# Altium schematic sheet Pre-Charge Detector.SchDoc
size A4; SheetNumber: 3; SheetTotal: 4
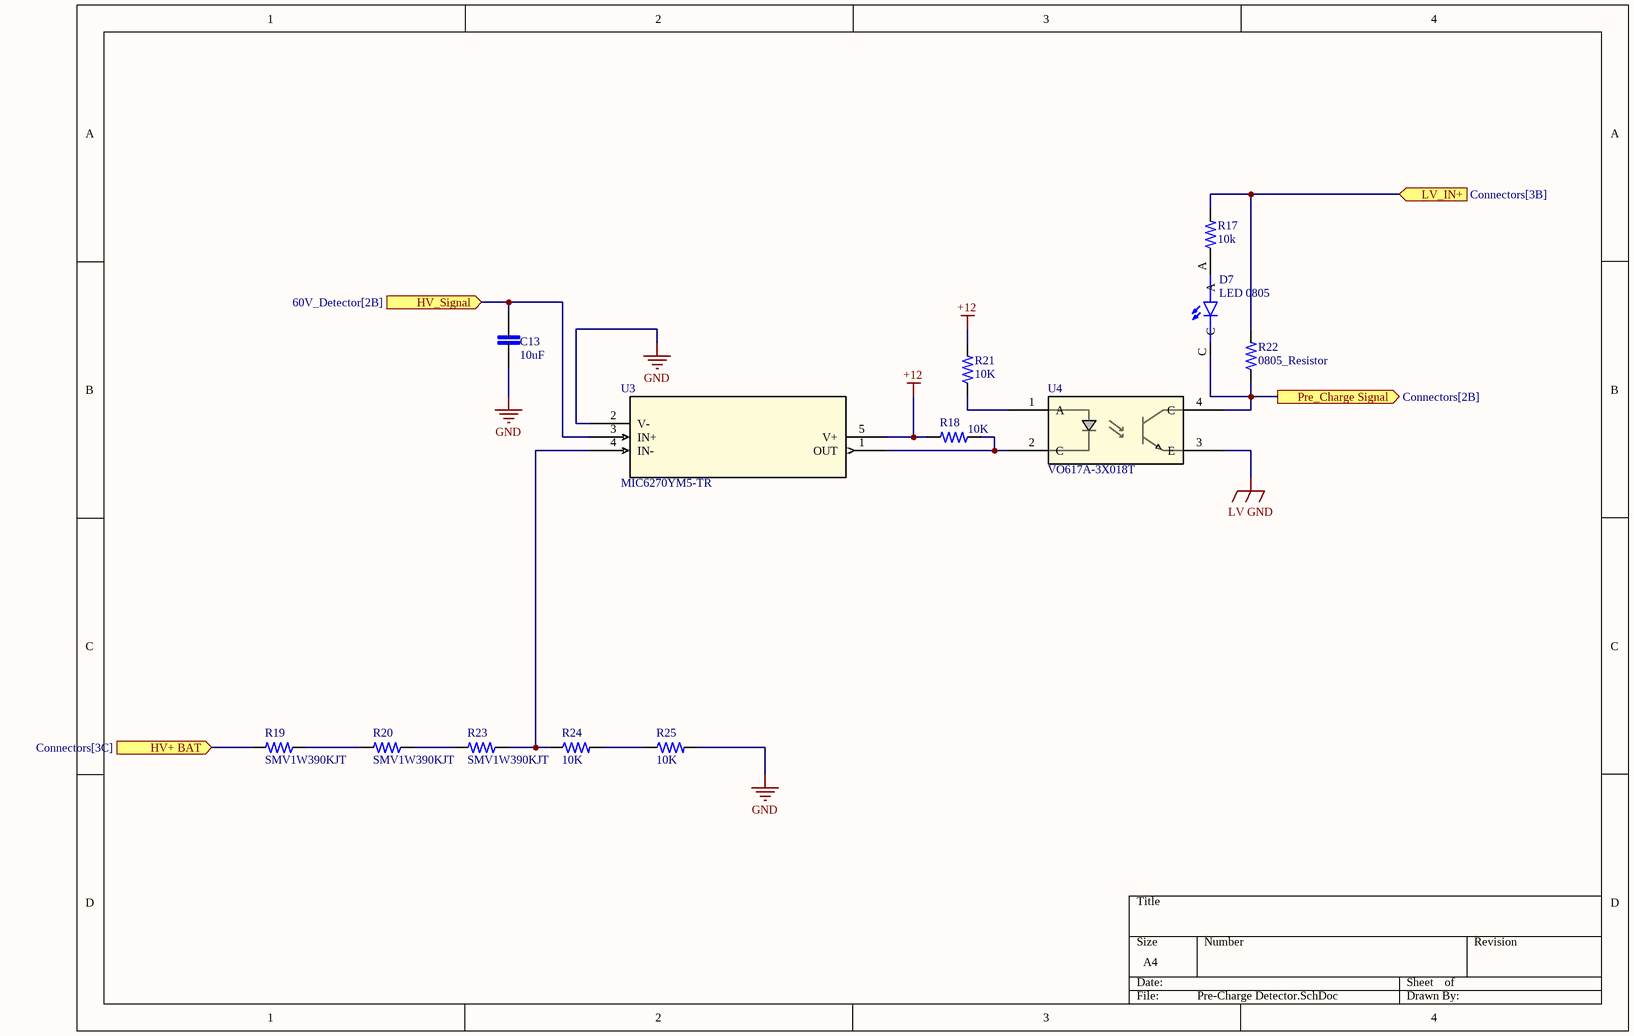
[diagram p0: Pre-Charge Detector.SchDoc]

## Parts
C13  10uF  [0805]
D7  LED 0805  [LED 0805]
R17  10k  [0805]
R18  10K  [0805]
R19  SMV1W390KJT  [SMV1W390KJT]
R20  SMV1W390KJT  [SMV1W390KJT]
R21  10K  [0805]
R22  0805_Resistor  [0805]
R23  SMV1W390KJT  [SMV1W390KJT]
R24  10K  [0805]
R25  10K  [0805]
U3  MIC6270YM5-TR  [MIC6270]
U4  VO617A-3X018T  [VO617A]

## Ports
HV+ BAT (in, see Connectors[3C]), HV_Signal (in, see 60V_Detector[2B]), LV_IN+ (in, see Connectors[3B]), Pre_Charge Signal (out, see Connectors[2B])

## Nets
+12: R18.2 R21.2 U3.5(V+)
GND: C13.1 R25.2 U3.2(V-)
LV GND: U4.3(E)
HV+ BAT: R19.2 ; port HV+ BAT
HV_Signal: C13.2 U3.3(IN+) ; port HV_Signal
LV_IN+: R17.2 R22.2 ; port LV_IN+
Pre_Charge Signal: D7.C R22.1 U4.4(C) ; port Pre_Charge Signal
NetD7_A: D7.A R17.1
NetR18_1: R18.1 U3.1(OUT) U4.2(C)
NetR19_1: R19.1 R20.2
NetR20_1: R20.1 R23.2
NetR21_1: R21.1 U4.1(A)
NetR23_1: R23.1 R24.1 U3.4(IN-)
NetR24_2: R24.2 R25.1

## Library data of the parts
C13 = 0805_Capacitor: MP: LD051A121KAB2A; MF: AVX; SnapEDA_Link: https://www.snapeda.com/parts/LD051A121KAB2A/AVX/view-part/?ref=snap; Package: 0805 AVX; Check_prices: https://www.snapeda.com/parts/LD051A121KAB2A/AVX/view-part/?ref=eda; Purchase-URL: https://pricing.snapeda.com/search/part/LD051A121KAB2A/?ref=eda; Price: None; Value: *; Availability: In Stock
D7 = LED 0805: LED Uni-Color Green 4-Pin Chip 0805 T/R; MP: 597-3305-607F; Availability: Unavailable; Value: *; Price: None; Package: None
R17 R18 R21 R22 R24 R25 = 0805_Resistor: Power_Rating: .25 W; MP: 2-2176053-0; Tolerance: 1%; Resistance: .33; MF: TE Connectivity; Price: None; Availability: In Stock; EU_RoHS_Compliance: Compliant with Exemptions; Package: 0805; Value: *; SnapEDA_Link: https://www.snapeda.com/parts/2-2176053-0/TE+Connectivity/view-part/?ref=snap; Check_prices: https://www.snapeda.com/parts/2-2176053-0/TE+Connectivity/view-part/?ref=eda
R19 R20 R23 = SMV1W390KJT: Power_Rating: .25 W; MP: 2-2176053-0; Tolerance: 1%; Resistance: .33; MF: TE Connectivity; Price: None; Availability: In Stock; EU_RoHS_Compliance: Compliant with Exemptions; Package: 0805; Value: *; SnapEDA_Link: https://www.snapeda.com/parts/2-2176053-0/TE+Connectivity/view-part/?ref=snap; Check_prices: https://www.snapeda.com/parts/2-2176053-0/TE+Connectivity/view-part/?ref=eda
U3 = MIC6270YM5-TR: No Description Available; Mfr_Name: Microchip; Copyright: Copyright (C) 2024 Ultra Librarian. All rights reserved.; Manufacturer_Part_Number: MIC6270YM5-TR; RefDes: RefDes; Type: DEV
U4 = VO617A: VO617A-3X018T Optocoupler Dc-in 1-CH Transistor Dc-out 4-PIN PDIP SMD T/r; NexarPartId: 68099910; Number of Channels: 1